# EAGLE schematic EMS4ChibaRobo (EAGLE 9.6.2)

## Sheet 1 of 2
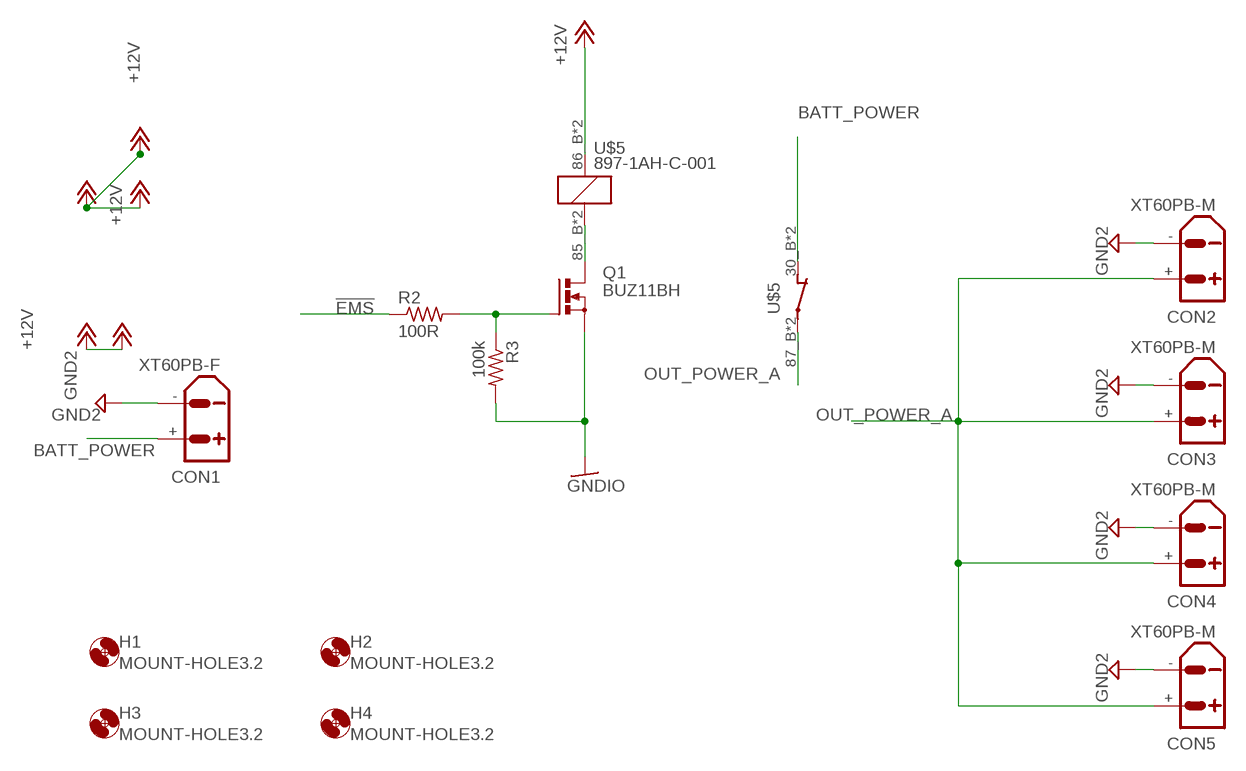
[diagram p0: schematic, sheet 1]

### Parts
CON1  XT60PB-F  [XT60PB-F]
CON2  XT60PB-M  [XT60PB-M]
CON3  XT60PB-M  [XT60PB-M]
CON4  XT60PB-M  [XT60PB-M]
CON5  XT60PB-M  [XT60PB-M]
H1  MOUNT-HOLE3.2  [3,2]
H2  MOUNT-HOLE3.2  [3,2]
H3  MOUNT-HOLE3.2  [3,2]
H4  MOUNT-HOLE3.2  [3,2]
Q1  BUZ11BH  [TO220BH]
R2  100R  R-US_R0603  [R0603]
R3  100k  R-US_R0603  [R0603]
U$5  897-1AH-C-001  [897-1AH-C-001]

### Nets
!EMS: R2.1 ; also sheet 2
+12V [12v]: U$5.86_B U$5.86_T ; also sheet 2
BATT_POWER: CON1.+ U$5.30_B(O) U$5.30_T(O)
GND2: CON1.- CON2.- CON3.- CON4.- CON5.-
GNDIO: Q1.S R3.2 ; also sheet 2
N$1: Q1.D U$5.85_B U$5.85_T
N$7: Q1.G R2.2 R3.1
OUT_POWER_A: CON2.+ CON3.+ CON4.+ CON5.+ U$5.87_B(P) U$5.87_T(P)

## Sheet 2 of 2
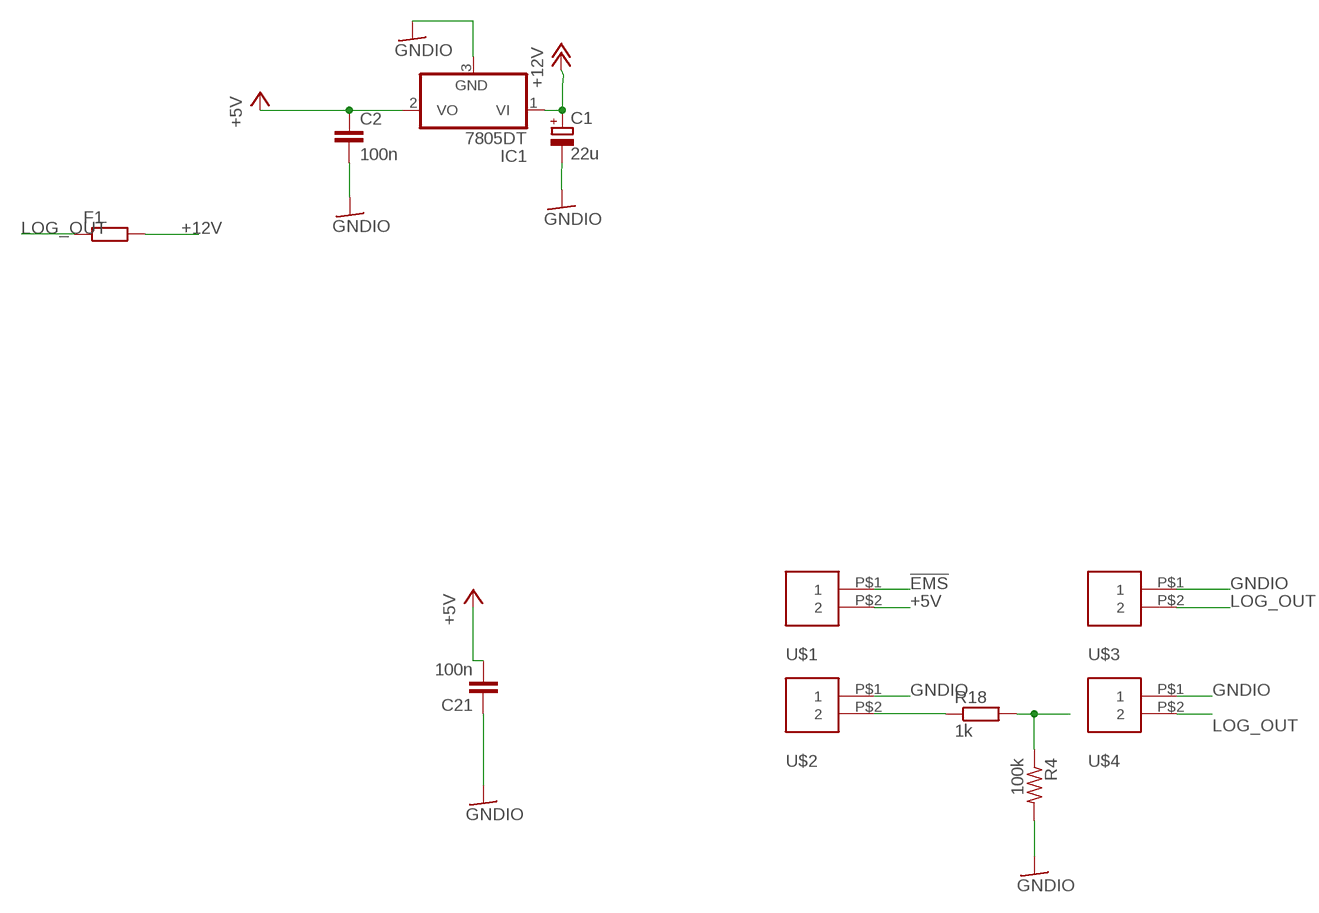
[diagram p1: schematic, sheet 2]

### Parts
C1  22u  CPOL-EUE2.5-5  [E2,5-5]
C2  100n  C-EUC0603  [C0603]
C21  100n  C-EUC0603  [C0603]
F1  R-EU_R1206  [R1206]
IC1  7805DT  [TO252]
R4  100k  R-US_R0603  [R0603]
R18  1k  R-EU_R0603  [R0603]
U$1  XH-2-STRAIGHT  [CON-XH-2-STRAIGHT]
U$2  XH-2-STRAIGHT  [CON-XH-2-STRAIGHT]
U$3  XH-2-STRAIGHT  [CON-XH-2-STRAIGHT]
U$4  XH-2-STRAIGHT  [CON-XH-2-STRAIGHT]

### Nets
!EMS: R4.1 R18.2 U$1.P$1 ; also sheet 1
!EMS1: R18.1 U$2.P$2
+5V: C2.1 C21.2 IC1.2(VO) U$1.P$2
+12V [12v]: C1.+ F1.2 IC1.1(VI) ; also sheet 1
GNDIO: C1.- C2.2 C21.1 IC1.3(GND) R4.2 U$2.P$1 U$3.P$1 U$4.P$1 ; also sheet 1
LOG_OUT [log_out]: F1.1 U$3.P$2 U$4.P$2

## Library data of the parts
C1 = rcl:CPOL-EU: POLARIZED CAPACITOR, European symbol; SPICEPREFIX: C
C2 = rcl:C-EU: CAPACITOR, European symbol; SPICEPREFIX: C
C21 = rcl:C-EU: CAPACITOR, European symbol
CON1-CON5 = amass:XT60: AMASS XT60 connector Store in Japan AMASS XT60 connector <https://szc.jp/ams-xt60>
F1 R18 = rcl:R-EU_: RESISTOR, European symbol; SPICEPREFIX: R
H1-H4 = holes:MOUNT-HOLE: MOUNTING HOLE with drill center marker
IC1 = linear:78*: Positive VOLTAGE REGULATOR Source: http://cache.national.com/ds/LM/LM78L05.pdf http://www.fairchildsemi.com/ds/LM/LM7805.pdf
Q1 = transistor-power:BUZ11: N-CHANNEL MOS FET
R2-R4 = rcl:R-US_: RESISTOR, American symbol; SPICEPREFIX: R
U$1-U$4 = con-xh:XH-2-STRAIGHT
U$5 = CRS_EAGLE_Lib:897-1AH-C-001

## Net classes
1 12v: width 1.5 mm
2 log_out: width 1.7 mm